# Altium schematic sheet BasicSAMD21.SchDoc
size A3
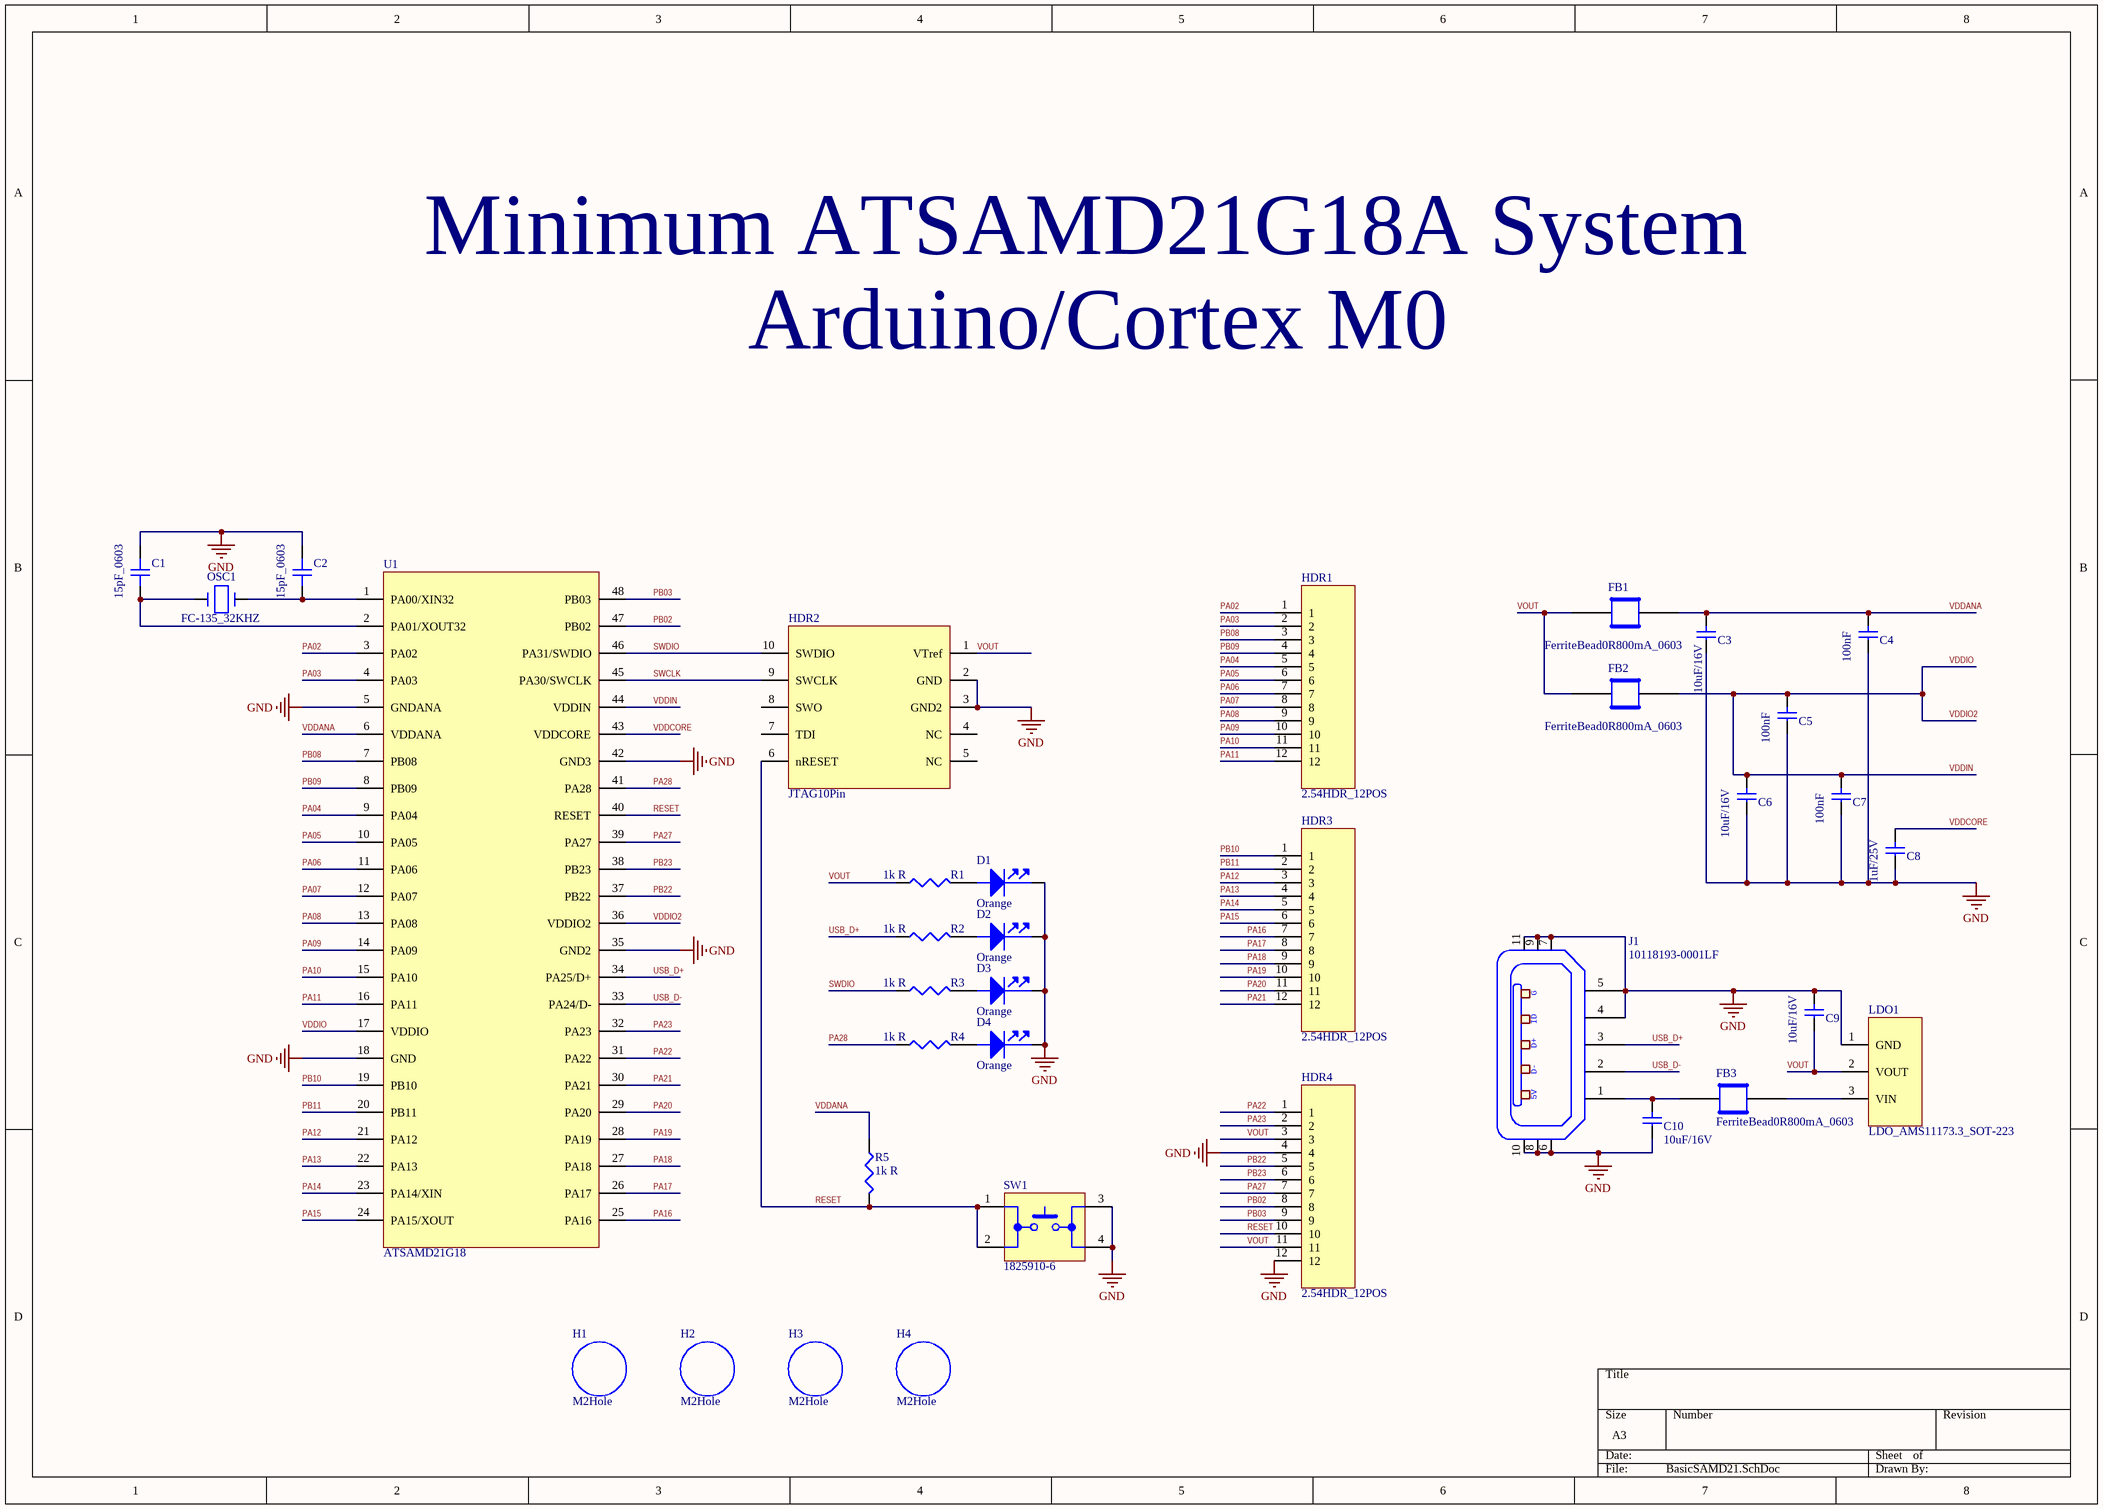
[diagram p0: BasicSAMD21.SchDoc]

## Parts
C1  15pF_0603  [C0603]
C2  15pF_0603  [C0603]
C3  10uF/16V  [C0805]
C4  100nF  [C0805]
C5  100nF  [C0805]
C6  10uF/16V  [C0805]
C7  100nF  [C0805]
C8  1uF/25V  [C0805]
C9  10uF/16V  [C0805]
C10  10uF/16V  [C0805]
D1  Orange  [LED_0603]
D2  Orange  [LED_0603]
D3  Orange  [LED_0603]
D4  Orange  [LED_0603]
FB1  FerriteBead0R800mA_0603  [C0603]
FB2  FerriteBead0R800mA_0603  [C0603]
FB3  FerriteBead0R800mA_0603  [C0603]
H1  M2Hole  [M2Hole]
H2  M2Hole  [M2Hole]
H3  M2Hole  [M2Hole]
H4  M2Hole  [M2Hole]
HDR1  2.54HDR_12POS  [DIP12]
HDR2  JTAG10Pin  [JTAG10]
HDR3  2.54HDR_12POS  [DIP12]
HDR4  2.54HDR_12POS  [DIP12]
J1  10118193-0001LF  [10118193]
LDO1  LDO_AMS11173.3_SOT-223  [SOT223]
OSC1  FC-135_32KHZ  [FC-135]
R1  1k R  [R0805]
R2  1k R  [R0805]
R3  1k R  [R0805]
R4  1k R  [R0805]
R5  1k R  [R0805]
SW1  1825910-6  [1825910-6]
U1  ATSAMD21G18  [TQFP48]

## Nets
GND: C1.2 C2.2 C3.1 C4.1 C5.1 C6.1 C7.1 C8.1 C9.2 C10.1 D1.1(Cathode) D2.1(Cathode) D3.1(Cathode) D4.1(Cathode) HDR2.2(GND) HDR2.3(GND2) HDR4.4 HDR4.12 J1.4 J1.5 J1.6 J1.7 J1.8 J1.9 J1.10 J1.11 LDO1.1(GND) SW1.3 SW1.4 U1.5(GNDANA) U1.18(GND) U1.35(GND2) U1.42(GND3)
PA02: HDR1.1 U1.3(PA02)
PA03: HDR1.2 U1.4(PA03)
PA04: HDR1.5 U1.9(PA04)
PA05: HDR1.6 U1.10(PA05)
PA06: HDR1.7 U1.11(PA06)
PA07: HDR1.8 U1.12(PA07)
PA08: HDR1.9 U1.13(PA08)
PA09: HDR1.10 U1.14(PA09)
PA10: HDR1.11 U1.15(PA10)
PA11: HDR1.12 U1.16(PA11)
PA12: HDR3.3 U1.21(PA12)
PA13: HDR3.4 U1.22(PA13)
PA14: HDR3.5 U1.23(PA14/XIN)
PA15: HDR3.6 U1.24(PA15/XOUT)
PA16: HDR3.7 U1.25(PA16)
PA17: HDR3.8 U1.26(PA17)
PA18: HDR3.9 U1.27(PA18)
PA19: HDR3.10 U1.28(PA19)
PA20: HDR3.11 U1.29(PA20)
PA21: HDR3.12 U1.30(PA21)
PA22: HDR4.1 U1.31(PA22)
PA23: HDR4.2 U1.32(PA23)
PA27: HDR4.7 U1.39(PA27)
PA28: R4.1 U1.41(PA28)
PB02: HDR4.8 U1.47(PB02)
PB03: HDR4.9 U1.48(PB03)
PB08: HDR1.3 U1.7(PB08)
PB09: HDR1.4 U1.8(PB09)
PB10: HDR3.1 U1.19(PB10)
PB11: HDR3.2 U1.20(PB11)
PB22: HDR4.5 U1.37(PB22)
PB23: HDR4.6 U1.38(PB23)
RESET: HDR2.6(nRESET) HDR4.10 R5.2 SW1.1 SW1.2 U1.40(RESET)
SWCLK: HDR2.9(SWCLK) U1.45(PA30/SWCLK)
SWDIO: HDR2.10(SWDIO) R3.1 U1.46(PA31/SWDIO)
USB_D+: J1.3 R2.1 U1.34(PA25/D+)
USB_D-: J1.2 U1.33(PA24/D-)
VDDANA: C3.2 C4.2 FB1.2 R5.1 U1.6(VDDANA)
VDDCORE: C8.2 U1.43(VDDCORE)
VDDIN: C5.2 C6.2 C7.2 FB2.2 U1.17(VDDIO) U1.36(VDDIO2) U1.44(VDDIN)  [also labelled VDDIO, VDDIO2]
VOUT: C9.1 FB1.1 FB2.1 HDR2.1(VTref) HDR4.3 HDR4.11 LDO1.2(VOUT) R1.1
NetC1_1: C1.1 OSC1.2 U1.2(PA01/XOUT32)
NetC2_1: C2.1 OSC1.1 U1.1(PA00/XIN32)
NetC10_2: C10.2 FB3.1 J1.1
NetD1_2: D1.2(Anode) R1.2
NetD2_2: D2.2(Anode) R2.2
NetD3_2: D3.2(Anode) R3.2
NetD4_2: D4.2(Anode) R4.2
NetFB3_2: FB3.2 LDO1.3(VIN)

Not connected (* = marked no-connect by the designer): HDR2 4(NC) 5(NC) 7(TDI) 8(SWO)

## Notes on the sheet
- Minimum ATSAMD21G18A System
- Arduino/Cortex M0
- (in symbol 10118193-0001LF) G; ID; D+; D-; 5V

## Library data of the parts
C3 C6 C9 C10 = C2012X5R1C106M125AC: CAP CER 10UF 16V X5R 0805; Manufacturer: TDK Corporation; Tolerance: ±20%; Supplier 1: Digi-Key; Manufacturer Part Number: C2012X5R1C106M125AC; RoHS: RoHS Compliant; Category: Capacitors; Stock 1: 0; Pricing 1: 1=0 (USD); Packaging: Cut Tape (CT); Part Status: Obsolete; Voltage - Rated: 16V; Temperature Coefficient: X5R; Operating Temperature: -55°C ~ 85°C; Features: Low ESL; Ratings: -; Applications: General Purpose; Failure Rate: -; Mounting Type: Surface Mount, MLCC; Package / Case: 0805 (2012 Metric); Size / Dimension: 0.079" L x 0.049" W (2.00mm x 1.25mm); Height - Seated (Max): -; Thickness (Max): 0.057" (1.45mm); Lead Spacing: -; Lead Style: -; ComponentLink1URL: https://product.tdk.com/info/en/catalog/datasheets/mlcc_commercial_general_en.pdf; ComponentLink1Description: https://product.tdk.com/info/en/catalog/datasheets/mlcc_commercial_general_en.pdf; Supplier Part Number 1: 445-4115-1-ND
C4 C5 C7 = C2012X7R1H104K085AA: CAP CER 0.1UF 50V X7R 0805; Manufacturer: TDK Corporation; Tolerance: ±10%; Notification: Current market demand for these product types have resulted in fluctuating and extending lead times. Lead times may differ.; Supplier 1: Digi-Key; Manufacturer Part Number: C2012X7R1H104K085AA; RoHS: RoHS Compliant; Category: Capacitors; Stock 1: 101021; Pricing 1: 1=0.12, 10=0.082, 100=0.0385, 500=0.027, 1000=0.02236 (USD); Packaging: Cut Tape (CT); Part Status: Not For New Designs; Voltage - Rated: 50V; Temperature Coefficient: X7R; Operating Temperature: -55°C ~ 125°C; Features: Low ESL; Ratings: -; Applications: General Purpose; Failure Rate: -; Mounting Type: Surface Mount, MLCC; Package / Case: 0805 (2012 Metric); Size / Dimension: 0.079" L x 0.049" W (2.00mm x 1.25mm); Height - Seated (Max): -; Thickness (Max): 0.037" (0.95mm); Lead Spacing: -; Lead Style: -; ComponentLink1URL: https://product.tdk.com/info/en/catalog/datasheets/mlcc_commercial_general_en.pdf; ComponentLink1Description: https://product.tdk.com/info/en/catalog/datasheets/mlcc_commercial_general_en.pdf; Supplier Part Number 1: 445-7534-1-ND
C8 = C2012X5R1E105K125AA: CAP CER 1UF 25V X5R 0805; Manufacturer: TDK Corporation; Tolerance: ±10%; Notification: Current market demand for these product types have resulted in fluctuating and extending lead times. Lead times may differ.; Supplier 1: Digi-Key; Manufacturer Part Number: C2012X5R1E105K125AA; RoHS: RoHS Compliant; Category: Capacitors; Stock 1: 774565; Pricing 1: 1=0.18, 10=0.129, 100=0.0605, 500=0.04244, 1000=0.03514 (USD); Packaging: Cut Tape (CT); Part Status: Not For New Designs; Voltage - Rated: 25V; Temperature Coefficient: X5R; Operating Temperature: -55°C ~ 85°C; Features: Low ESL; Ratings: -; Applications: General Purpose; Failure Rate: -; Mounting Type: Surface Mount, MLCC; Package / Case: 0805 (2012 Metric); Size / Dimension: 0.079" L x 0.049" W (2.00mm x 1.25mm); Height - Seated (Max): -; Thickness (Max): 0.057" (1.45mm); Lead Spacing: -; Lead Style: -; ComponentLink1URL: https://product.tdk.com/info/en/catalog/datasheets/mlcc_commercial_general_en.pdf; ComponentLink1Description: https://product.tdk.com/info/en/catalog/datasheets/mlcc_commercial_general_en.pdf; Supplier Part Number 1: 445-1419-1-ND
D1-D4 = LO L29K-H2K1-24-Z: LED ORANGE DIFFUSED 0603 SMD; Manufacturer: OSRAM Opto Semiconductors Inc.; Lens Color: White; Millicandela Rating: 6.3mcd; Lens Style/Size: Rectangle with Flat Top, 1.30mm x 0.80mm; Voltage - Forward (Vf) (Typ): 1.8V; Current - Test: 2mA; Viewing Angle: 160°; Wavelength - Dominant: 606nm; Wavelength - Peak: 610nm; Supplier 1: Digi-Key; Manufacturer Part Number: LO L29K-H2K1-24-Z; RoHS: RoHS Compliant; Category: Optoelectronics; Stock 1: 8500; Pricing 1: 1=0.51, 10=0.359, 25=0.3116, 100=0.2396, 250=0.19468, 500=0.14376, 1000=0.1198, 2500=0.10782 (USD); Packaging: Cut Tape (CT); Part Status: Active; Color: Orange; Lens Transparency: Diffused; Mounting Type: Surface Mount; Features: -; Package / Case: 0603 (1608 Metric); Supplier Device Package: 0603; Size / Dimension: 1.70mm L x 0.80mm W; Height (Max): 0.65mm; ComponentLink1URL: https://dammedia.osram.info/media/resource/hires/osram-dam-2493882/LO%20L29K.pdf; ComponentLink1Description: https://dammedia.osram.info/media/resource/hires/osram-dam-2493882/LO%20L29K.pdf; Supplier Part Number 1: 475-2740-1-ND
HDR2 = JTAG_10Pin
J1 = 10118193-0001LF: CONN USB MICRO B RECPT SMT R/A; Manufacturer: Amphenol FCI; Connector Type: USB - micro B; Number of Contacts: 5; Gender: Receptacle; Specifications: USB 2.0; Current Rating: 1.8A per Contact; Voltage - Rated: 100VAC; Mating Cycles: 10000; Shielding: Shielded; Material Flammability Rating: UL94 V-0; Supplier 1: Digi-Key; Manufacturer Part Number: 10118193-0001LF; RoHS: RoHS Compliant; Category: Connectors, Interconnects; Stock 1: 104127; Pricing 1: 1=0.46, 10=0.437, 25=0.3744, 50=0.318, 100=0.3056, 250=0.27444, 500=0.26196 (USD); Packaging: Cut Tape (CT); Part Status: Active; Mounting Type: Surface Mount, Right Angle; Through Hole; Mounting Feature: Horizontal; Termination: Solder; Features: Solder Retention; Ingress Protection: -; Operating Temperature: -30°C ~ 80°C; Contact Finish: Gold; Shell/Shielding Material: Steel, Stainless; Insulation Color: Black; ComponentLink1URL: http://cdn.amphenol-icc.com/media/wysiwyg/files/drawing/10118193.pdf; ComponentLink1Description: http://cdn.amphenol-icc.com/media/wysiwyg/files/drawing/10118193.pdf; Supplier Part Number 1: 609-4616-1-ND
OSC1 = FC-135R32.7680KA-A3: 32.768kHz ±20ppm Crystal 12.5pF 50 kOhm -40°C ~ 85°C  Surface Mount 2-SMD, No Lead (DFN, LCC); Manufacturer: Epson; ESR (Equivalent Series Resistance): 50 kOhm; Operating Mode: Fundamental; Supplier 1: Digi-Key; Manufacturer Part Number: FC-135R32.7680KA-A3; Stock 1: 2024; Pricing 1: 1=0.59, 10=0.495, 50=0.4456, 100=0.396 (USD); Category: Crystals and Oscillators; Family: Crystals; Series: FC-135R; Packaging: Cut Tape (CT); Type: kHz Crystal (Tuning Fork); Frequency: 32.768kHz; Frequency Stability: -; Frequency Tolerance: ±20ppm; Load Capacitance: 12.5pF; Operating Temperature: -40°C ~ 85°C; Ratings: -; Mounting Type: Surface Mount; Package / Case: 2-SMD, No Lead (DFN, LCC); Size / Dimension: 0.126" L x 0.061" W (3.20mm x 1.50mm); Height: 0.035" (0.90mm)
R1-R5 = RC0805FR-071KL: RES SMD 1K OHM 1% 1/8W 0805; Manufacturer: Yageo; Power (Watts): 0.125W, 1/8W; Temperature Coefficient: ±100ppm/°C; Supplier 1: Digi-Key; Manufacturer Part Number: RC0805FR-071KL; RoHS: RoHS Compliant; Category: Resistors; Stock 1: 8527092; Pricing 1: 1=0.1, 10=0.022, 100=0.0088, 1000=0.00396, 2500=0.00344 (USD); Packaging: Cut Tape (CT); Part Status: Active; Tolerance: ±1%; Composition: Thick Film; Features: Moisture Resistant; Operating Temperature: -55°C ~ 155°C; Package / Case: 0805 (2012 Metric); Supplier Device Package: 0805; Size / Dimension: 0.079" L x 0.049" W (2.00mm x 1.25mm); Height - Seated (Max): 0.024" (0.60mm); Failure Rate: -; ComponentLink1URL: http://www.yageo.com/documents/recent/PYu-RC_Group_51_RoHS_L_8.pdf; ComponentLink1Description: http://www.yageo.com/documents/recent/PYu-RC_Group_51_RoHS_L_8.pdf; Supplier Part Number 1: 311-1.00KCRCT-ND
SW1 = 1825910-6: SWITCH TACTILE SPST-NO 0.05A 24V; Manufacturer: TE Connectivity ALCOSWITCH Switches; Switch Function: Off-Mom; Contact Rating @ Voltage: 0.05A @ 24VDC; Actuator Type: Standard; Actuator Height off PCB, Vertical: 5.00mm; Actuator Orientation: Top Actuated; Outline: 6.00mm x 6.00mm; Illumination: Non-Illuminated; Operating Force: 160gf; Actuator Material: Polybutylene Terephthalate (PBT); Switch Travel: 0.25mm; Mechanical Life: 100,000 Cycles; Supplier 1: Digi-Key; Manufacturer Part Number: 1825910-6; RoHS: RoHS Compliant; Category: Switches; Stock 1: 88203; Pricing 1: 1=0.1, 10=0.091, 25=0.0876, 50=0.0844, 100=0.0798, 250=0.07508, 500=0.07196, 1000=0.05475, 5000=0.04536 (USD); Packaging: Bulk; Part Status: Active; Circuit: SPST-NO; Mounting Type: Through Hole; Actuator Length, Right Angle: -; Termination Style: PC Pin; Illumination Type, Color: -; Illumination Voltage (Nominal): -; Ingress Protection: -; Features: -; Operating Temperature: -35°C ~ 85°C; ComponentLink1URL: http://www.te.com/commerce/DocumentDelivery/DDEController?Action=srchrtrv&DocNm=1825910&DocType=Customer+Drawing&DocLang=English; ComponentLink1Description: http://www.te.com/commerce/DocumentDelivery/DDEController?Action=srchrtrv&DocNm=1825910&DocType=Customer+Drawing&DocLang=English; Supplier Part Number 1: 450-1650-ND
U1 = ATSAMD21G18A-AUT: IC MCU 32BIT 256KB FLASH 48TQFP; Manufacturer: Microchip; Supplier 1: Digi-Key; Manufacturer Part Number: ATSAMD21G18A-AUT; Stock 1: 16813; Pricing 1: 1=3.22, 25=2.9252, 100=2.6574 (USD)